# Altium schematic sheet I_O.SchDoc
size A4; SheetNumber: 4; SheetTotal: 5
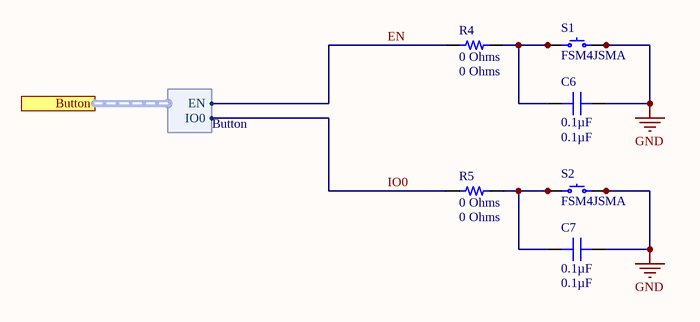
[diagram p0: I_O.SchDoc]

## Parts
C6  0.1µF  [CAP 0805_2012]
C7  0.1µF  [CAP 0805_2012]
R4  0 Ohms  [RES 0805_2012]
R5  0 Ohms  [RES 0805_2012]
S1  FSM4JSMA  [TE FSM4JSMA]
S2  FSM4JSMA  [TE FSM4JSMA]

## Ports
Button (harness Button)

## Harnesses
Button: EN, IO0

## Nets
GND: C6.1 C7.1 S1.3 S1.4 S2.3 S2.4
EN: R4.1 ; port Button.EN
IO0: R5.1 ; port Button.IO0
NetC6_2: C6.2 R4.2 S1.1 S1.2
NetC7_2: C7.2 R5.2 S2.1 S2.2

## Library data of the parts
C6 C7 = 0805ZD104KAT2A: CAP CER 0.1UF 10V X5R 0805; Part Number: 0805ZD104KAT2A; Value: 0.1µF
R4 R5 = CRCW08050000Z0EBC: RES 0 OHM JUMPER 1/8W 0805; Part Number: CRCW08050000Z0EBC; Value: 0 Ohms
S1 S2 = FSM4JSMA: SWITCH TACTILE SPST-NO 0.05A 24V; Manufacturer: TE Connectivity ALCOSWITCH Switches; Actuator Height off PCB, Vertical: 5.00mm; Actuator Orientation: Top Actuated; Actuator Type: Standard; Contact Rating @ Voltage: 0.05A @ 24VDC; Illumination: Non-Illuminated; Operating Force: 160gf; Outline: 6.00mm x 6.00mm; Switch Function: Off-Mom; Part Number: FSM4JSMA; Circuit: SPST-NO; ComponentLink1Description: Datasheet; ComponentLink1URL: https://www.te.com/commerce/DocumentDelivery/DDEController?Action=srchrtrv&DocNm=1308111-1_SWITCHES_CORE_PROGRAM_CATALOG&DocType=CS&DocLang=English; ComponentLink2Description: DigiKey Link; ComponentLink2URL: https://www.digikey.com/en/products/detail/te-connectivity-alcoswitch-switches/FSM4JSMA/525821; LastUpdated: 19/09/2022 2:02:57 PM; Lifecycle Status: Active; Minimum Order: 1; Mounting Type: Surface Mount; Operating Temperature: -35°C ~ 85°C; Packaging: Bulk; Part Status: Active; Price: 0.14; Series: FSMJSMA; Supplier 1: DigiKey; Supplier Part Number 1: 450-1129-ND; Termination Style: Gull Wing